# Altium schematic sheet HearingAid.SchDoc
size A4
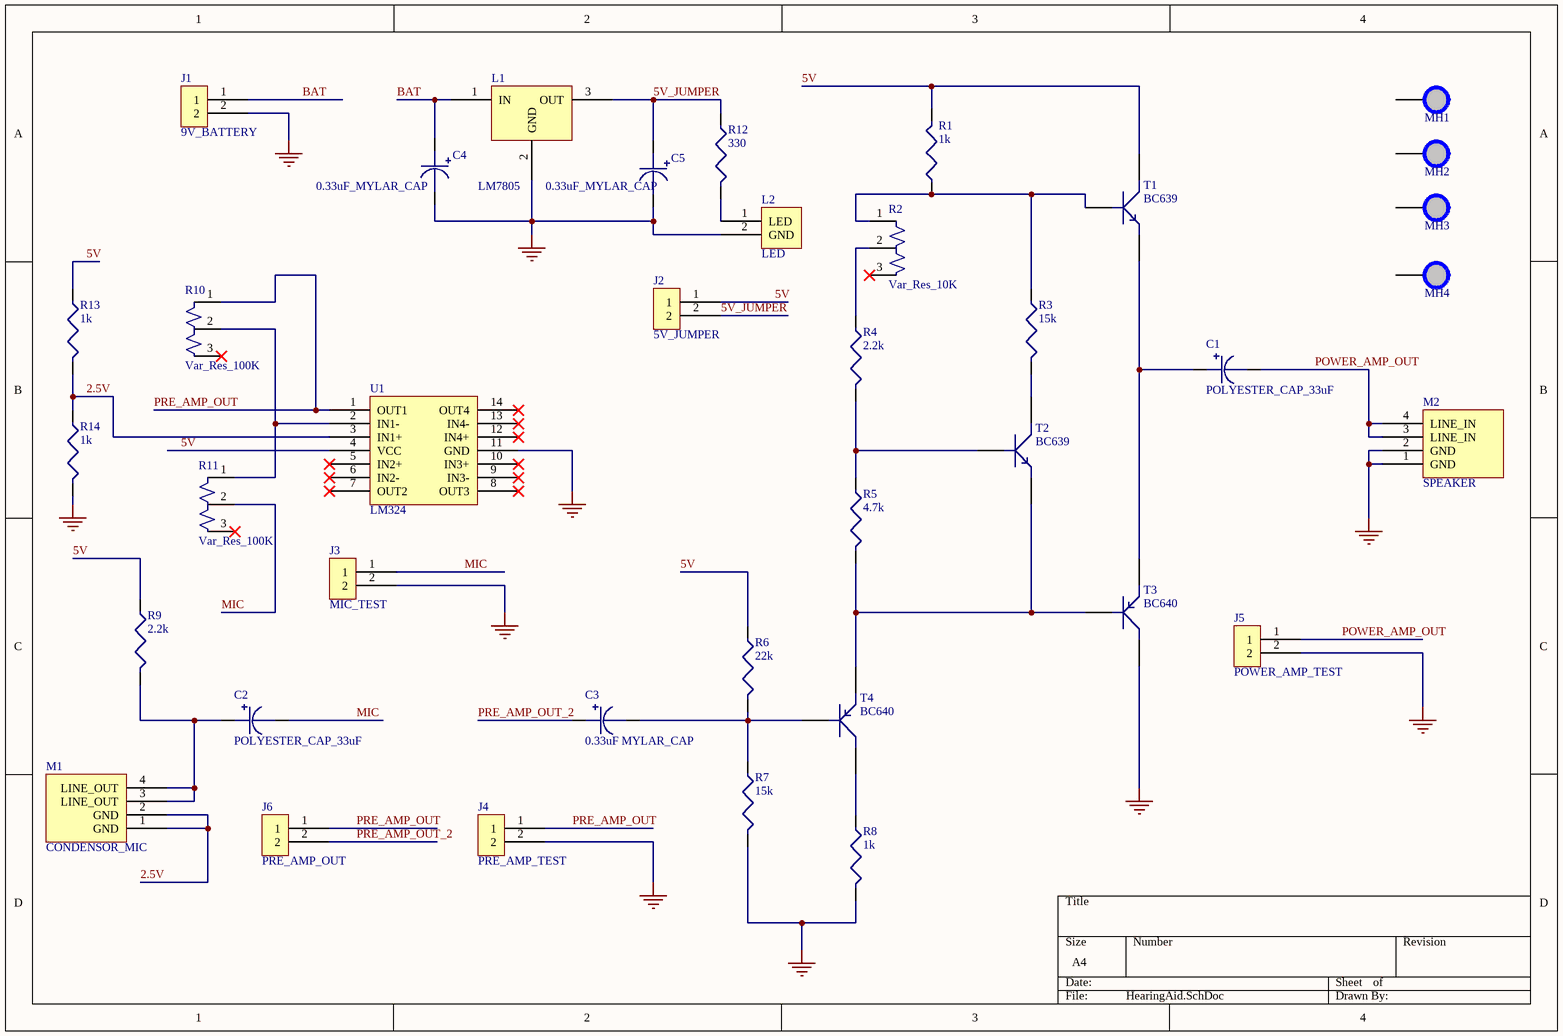
[diagram p0: HearingAid.SchDoc]

## Parts
C1  POLYESTER_CAP_33uF  [POLYESTER_CAP2]
C2  POLYESTER_CAP_33uF  [POLYESTER_CAP2]
C3  0.33uF MYLAR_CAP  [POLYESTER_CAP2]
C4  0.33uF_MYLAR_CAP  [POLYESTER_CAP2]
C5  0.33uF_MYLAR_CAP  [POLYESTER_CAP2]
J1  9V_BATTERY  [HEADER_MALE_2_POS]
J2  5V_JUMPER  [HEADER_MALE_2_POS]
J3  MIC_TEST  [HEADER_MALE_2_POS]
J4  PRE_AMP_TEST  [HEADER_MALE_2_POS]
J5  POWER_AMP_TEST  [HEADER_MALE_2_POS]
J6  PRE_AMP_OUT  [HEADER_MALE_2_POS]
L1  LM7805  [LM7805]
L2  LED  [LED_3mm]
M1  CONDENSOR_MIC  [CONDENSOR_MIC]
M2  SPEAKER  [SPEAKER]
MH1  MOUNTING_HOLE_3mm_NON_PLATED  [MOUNTING_HOLE_3mm_NONPLATED]  (value not drawn)  (no BOM)
MH2  MOUNTING_HOLE_3mm_NON_PLATED  [MOUNTING_HOLE_3mm_NONPLATED]  (value not drawn)  (no BOM)
MH3  MOUNTING_HOLE_3mm_NON_PLATED  [MOUNTING_HOLE_3mm_NONPLATED]  (value not drawn)  (no BOM)
MH4  MOUNTING_HOLE_3mm_NON_PLATED  [MOUNTING_HOLE_3mm_NONPLATED]  (value not drawn)  (no BOM)
R1  1k  [Axial_Res]
R2  Var_Res_10K  [TRIMMER_10K]
R3  15k  [Axial_Res]
R4  2.2k  [Axial_Res]
R5  4.7k  [Axial_Res]
R6  22k  [Axial_Res]
R7  15k  [Axial_Res]
R8  1k  [Axial_Res]
R9  2.2k  [Axial_Res]
R10  Var_Res_100K  [TRIMMER_10K]
R11  Var_Res_100K  [TRIMMER_10K]
R12  330  [Axial_Res]
R13  1k  [Axial_Res]
R14  1k  [Axial_Res]
T1  BC639  [BC639]
T2  BC639  [BC639]
T3  BC640  [BC640]
T4  BC640  [BC640]
U1  LM324  [LM324]

## Nets
GND: C4.2 C5.2 J1.2 J3.2 J4.2 J5.2 L1.2(GND) L2.2(GND) M2.1(GND) M2.2(GND) R7.2 R8.2 R14.2 T3.2 U1.11(GND)
2.5V: M1.1(GND) M1.2(GND) R13.2 R14.1 U1.3(IN1+)
5V: J2.1 R1.2 R6.1 R9.1 R13.1 T1.2 U1.4(VCC)
5V_JUMPER: C5.1 J2.2 L1.3(OUT) R12.1
BAT: C4.1 J1.1 L1.1(IN)
MIC: C2.2 J3.1 R11.2
POWER_AMP_OUT: C1.2 J5.1 M2.3(LINE_IN) M2.4(LINE_IN)
PRE_AMP_OUT: J4.1 J6.1 R10.1 U1.1(OUT1)
PRE_AMP_OUT_2: C3.1 J6.2
NetC1_1: C1.1 T1.1 T3.1
NetC2_1: C2.1 M1.3(LINE_OUT) M1.4(LINE_OUT) R9.2
NetC3_2: C3.2 R6.2 R7.1 T4.3
NetL2_1: L2.1(LED) R12.2
NetR1_1: R1.1 R2.1 R3.1 T1.3
NetR2_2: R2.2 R4.1
NetR3_2: R3.2 T2.2
NetR4_2: R4.2 R5.1 T2.3
NetR5_2: R5.2 T2.1 T3.3 T4.1
NetR8_1: R8.1 T4.2
NetR10_2: R10.2 R11.1 U1.2(IN1-)

Not connected (* = marked no-connect by the designer): MH1 1; MH2 1; MH3 1; MH4 1; R2 3*; R10 3*; R11 3*; U1 5(IN2+)* 6(IN2-)* 7(OUT2)* 8(OUT3)* 9(IN3-)* 10(IN3+)* 12(IN4+)* 13(IN4-)* 14(OUT4)*

## Library data of the parts
C1-C5 = POLYESTER_CAP2
J1-J6 = HEADER_MALE_2_POS
R1 R3-R9 R12-R14 = Axial_Res
R2 R10 R11 = TRIMMER_10K: Res Cermet Trimmer 10K Ohm 10% 0.5W 25(Elec)Turn (17.27 X 6.1 X 11.68mm) Pin Panel Mount/Through Hole Tube; Manufacturer: Bourns; Manufacturer Part Number: 3292W-1-103MLF; Resistance Value: 10 KOhm; Number of Turns: 25(Elec) Turns; Power Rating: 1/2 W; Rad Hard: No; Supplier 1: Mouser; Stock 1: 100; Pricing 1: 1=23.15, 10=21.3, 50=15.75, 100=14.53, 1000=13.16, 10000=13.16 (USD); Packaging: Rail / Tube; Type: Trimmer; Tolerance: 10 %; Mounting: Panel Mount/Through Hole; Technology: Cermet; Operating Temperature: -65 to 150 °C; ComponentLink1URL: http://www.bourns.com/docs/Product-Datasheets/3292.pdf?src-supplier=Digi-Key; ComponentLink1Description: http://www.bourns.com/docs/Product-Datasheets/3292.pdf?src-supplier=Digi-Key; ComponentLink2URL: http://www.bourns.com/data/global/pdfs/3292.pdf?src-supplier=Avnet; ComponentLink2Description: http://www.bourns.com/data/global/pdfs/3292.pdf?src-supplier=Avnet; Supplier Part Number 1: 652-3292W-1-103MLF